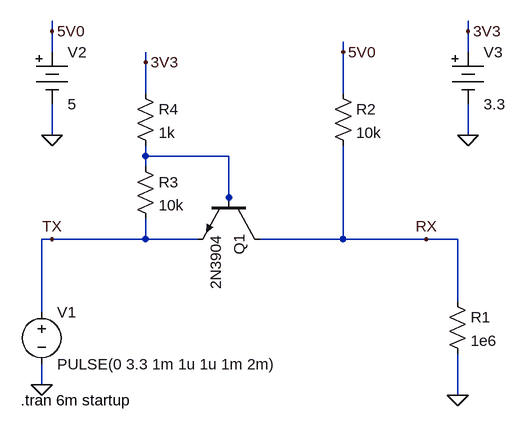
[diagram p0: schematic level_shifter.asc]
level_shifter.asc, the LTspice schematic file:
Version 4
SHEET 1 880 680
WIRE 0 -48 0 -64
WIRE 640 -48 640 -64
WIRE 0 -16 0 -48
WIRE 448 -16 448 -32
WIRE 640 -16 640 -48
WIRE 144 0 144 -16
WIRE 144 48 144 0
WIRE 448 48 448 -16
WIRE 0 112 0 64
WIRE 640 112 640 64
WIRE 144 144 144 128
WIRE 272 144 144 144
WIRE 144 160 144 144
WIRE 272 208 272 144
WIRE 272 224 272 208
WIRE 0 272 -16 272
WIRE 144 272 144 240
WIRE 144 272 0 272
WIRE 224 272 144 272
WIRE 448 272 448 128
WIRE 448 272 320 272
WIRE 576 272 448 272
WIRE 624 272 576 272
WIRE 624 368 624 272
WIRE -16 384 -16 272
WIRE -16 496 -16 464
WIRE 624 512 624 448
FLAG 0 112 0
FLAG 0 -48 5V0
FLAG 640 112 0
FLAG 640 -48 3V3
FLAG 144 0 3V3
FLAG 448 -16 5V0
FLAG -16 496 0
FLAG 0 272 TX
FLAG 576 272 RX
FLAG 624 512 0
SYMBOL voltage -16 368 R0
WINDOW 123 0 0 Left 0
WINDOW 39 0 0 Left 0
SYMATTR InstName V1
SYMATTR Value PULSE(0 3.3 1m 1u 1u 1m 2m)
SYMBOL Misc\\battery 0 -32 R0
WINDOW 123 0 0 Left 0
WINDOW 39 0 0 Left 0
SYMATTR InstName V2
SYMATTR Value 5
SYMBOL Misc\\battery 640 -32 R0
WINDOW 123 0 0 Left 0
WINDOW 39 0 0 Left 0
SYMATTR InstName V3
SYMATTR Value 3.3
SYMBOL res 432 32 R0
SYMATTR InstName R2
SYMATTR Value 10k
SYMBOL res 128 144 R0
SYMATTR InstName R3
SYMATTR Value 10k
SYMBOL res 608 352 R0
SYMATTR InstName R1
SYMATTR Value 1e6
SYMBOL npn 320 208 R90
SYMATTR InstName Q1
SYMATTR Value 2N3904
SYMBOL res 128 32 R0
SYMATTR InstName R4
SYMATTR Value 1k
TEXT -48 520 Left 2 !.tran 6m startup

The netlist it stands for:
* level_shifter.asc
V1 TX 0 PULSE(0 3.3 1m 1u 1u 1m 2m)
V2 5V0 0 5
V3 3V3 0 3.3
R2 5V0 RX 10k
R3 N001 TX 10k
R1 RX 0 1e6
Q1 RX N001 TX 0 2N3904
R4 3V3 N001 1k
.model NPN NPN
.model PNP PNP
.lib standard.bjt
.tran 6m startup
.backanno
.end